# EAGLE design sensor_pcb (EAGLE 7.0.0)
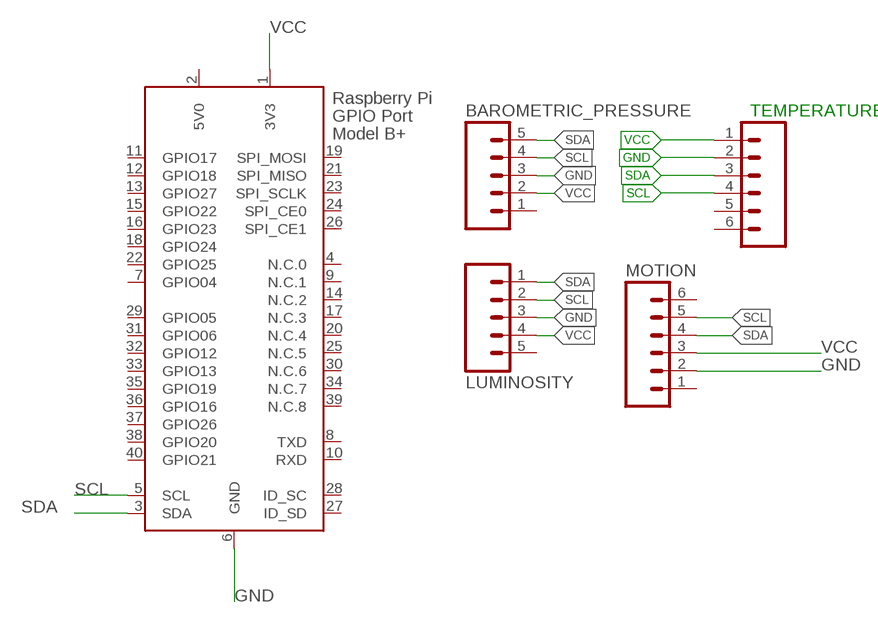
[diagram p0: schematic, sheet 1]

## Parts
BAROMETRIC_PRESSURE  M05_ROUNDONLY_NOSILK  [1X05_ROUNDONLY_NOSILK]
LUMINOSITY  M05_ROUNDONLY_NOSILK  [1X05_ROUNDONLY_NOSILK]
MOTION  M06SIP  [1X06]
TEMPERATURE  M06SIP  [1X06]
X1  RASPI_BOARD_B+_E0  [RASPI_BOARD_B+_EDGES_0DRILL]

## Nets
GND: BAROMETRIC_PRESSURE.3 LUMINOSITY.3 MOTION.2 TEMPERATURE.2 X1.6(GND)
SCL: BAROMETRIC_PRESSURE.4 LUMINOSITY.2 MOTION.5 TEMPERATURE.4 X1.5(SCL)
SDA: BAROMETRIC_PRESSURE.5 LUMINOSITY.1 MOTION.4 TEMPERATURE.3 X1.3(SDA)
VCC: BAROMETRIC_PRESSURE.2 LUMINOSITY.4 MOTION.3 TEMPERATURE.1 X1.1(3V3)
Unconnected: BAROMETRIC_PRESSURE.1 LUMINOSITY.5 MOTION.1 MOTION.6 TEMPERATURE.5 TEMPERATURE.6 X1.4(N.C.0) X1.7(GPIO04) X1.8(TXD) X1.9(N.C.1) X1.10(RXD) X1.11(GPIO17) X1.12(GPIO18) X1.13(GPIO27) X1.14(N.C.2) X1.15(GPIO22) X1.16(GPIO23) X1.17(N.C.3) X1.18(GPIO24) X1.19(SPI_MOSI) X1.20(N.C.4) X1.21(SPI_MISO) X1.22(GPIO25) X1.23(SPI_SCLK) X1.24(SPI_CE0) X1.25(N.C.5) X1.26(SPI_CE1) X1.27(ID_SD) X1.28(ID_SC) X1.29(GPIO05) X1.30(N.C.6) X1.31(GPIO06) X1.32(GPIO12) X1.33(GPIO13) X1.34(N.C.7) X1.35(GPIO19) X1.36(GPIO16) X1.37(GPIO26) X1.38(GPIO20) X1.39(N.C.8) X1.40(GPIO21)

## Power pins joined to a net without a drawn wire
5V0: X1.2(5V0)

## Library data of the parts
BAROMETRIC_PRESSURE LUMINOSITY = mike-temp:M05: Header 5 Standard 5-pin 0.1" header. Use with straight break away headers (SKU : PRT-00116), right angle break away headers (PRT-00553), swiss pins (PRT-00743), machine pins (PRT-00117), and female headers (PRT-00115). Molex polarized connector foot print use with SKU : PRT-08230 with associated crimp pins and housings.
MOTION = SparkFun-Connectors:M06: Header 6 Standard 6-pin 0.1" header. Use with straight break away headers (SKU : PRT-00116), right angle break away headers (PRT-00553), swiss pins (PRT-00743), machine pins (PRT-00117), and female headers (PRT-00115). Molex polarized connector foot print use with SKU : PRT-08094 with associated ...
TEMPERATURE = SparkFun:M06: Header 6 Standard 6-pin 0.1" header. Use with straight break away headers (SKU : PRT-00116), right angle break away headers (PRT-00553), swiss pins (PRT-00743), machine pins (PRT-00117), and female headers (PRT-00115). Molex polarized connector foot print use with SKU : PRT-08094 with associated ...
X1 = raspberrypi_bastelstube_v13:RASPI_BOARD_B+: Raspberry Pi GPIO connector with markings for the outer dimensions of the Raspberry Pi board model B+ with different sets of drill holes or mounting pads

## Board
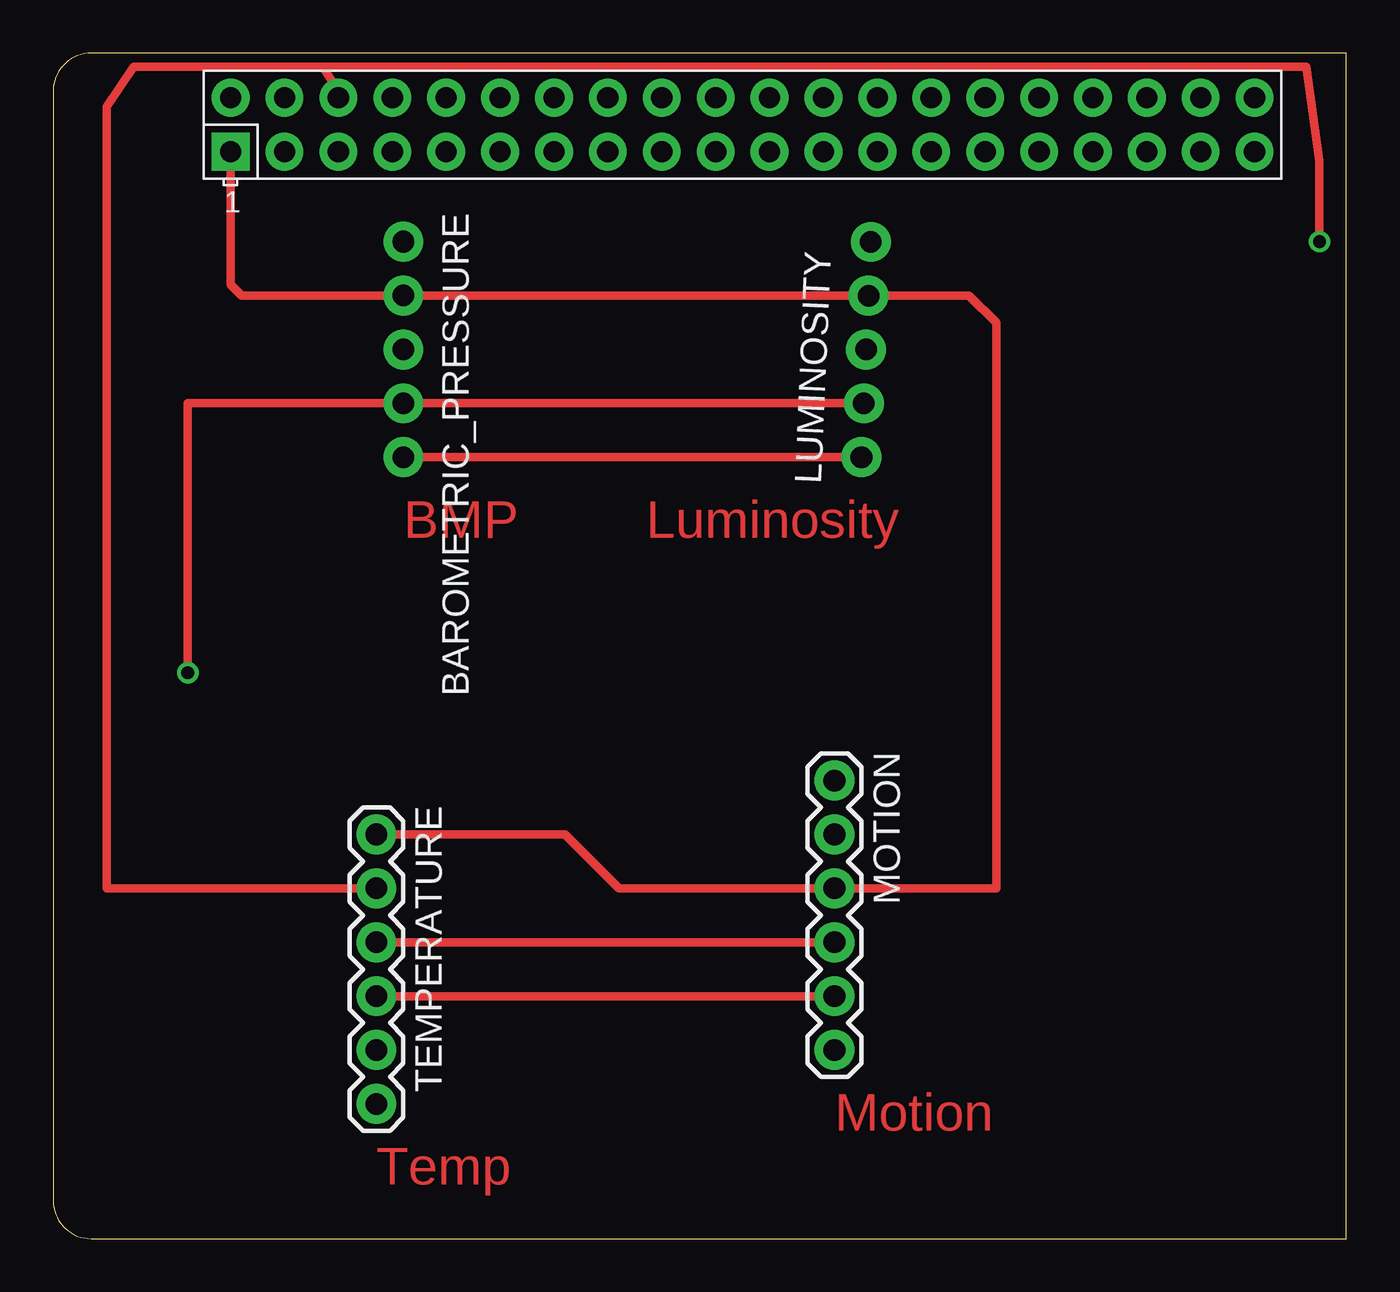
[diagram p1: board, top side]
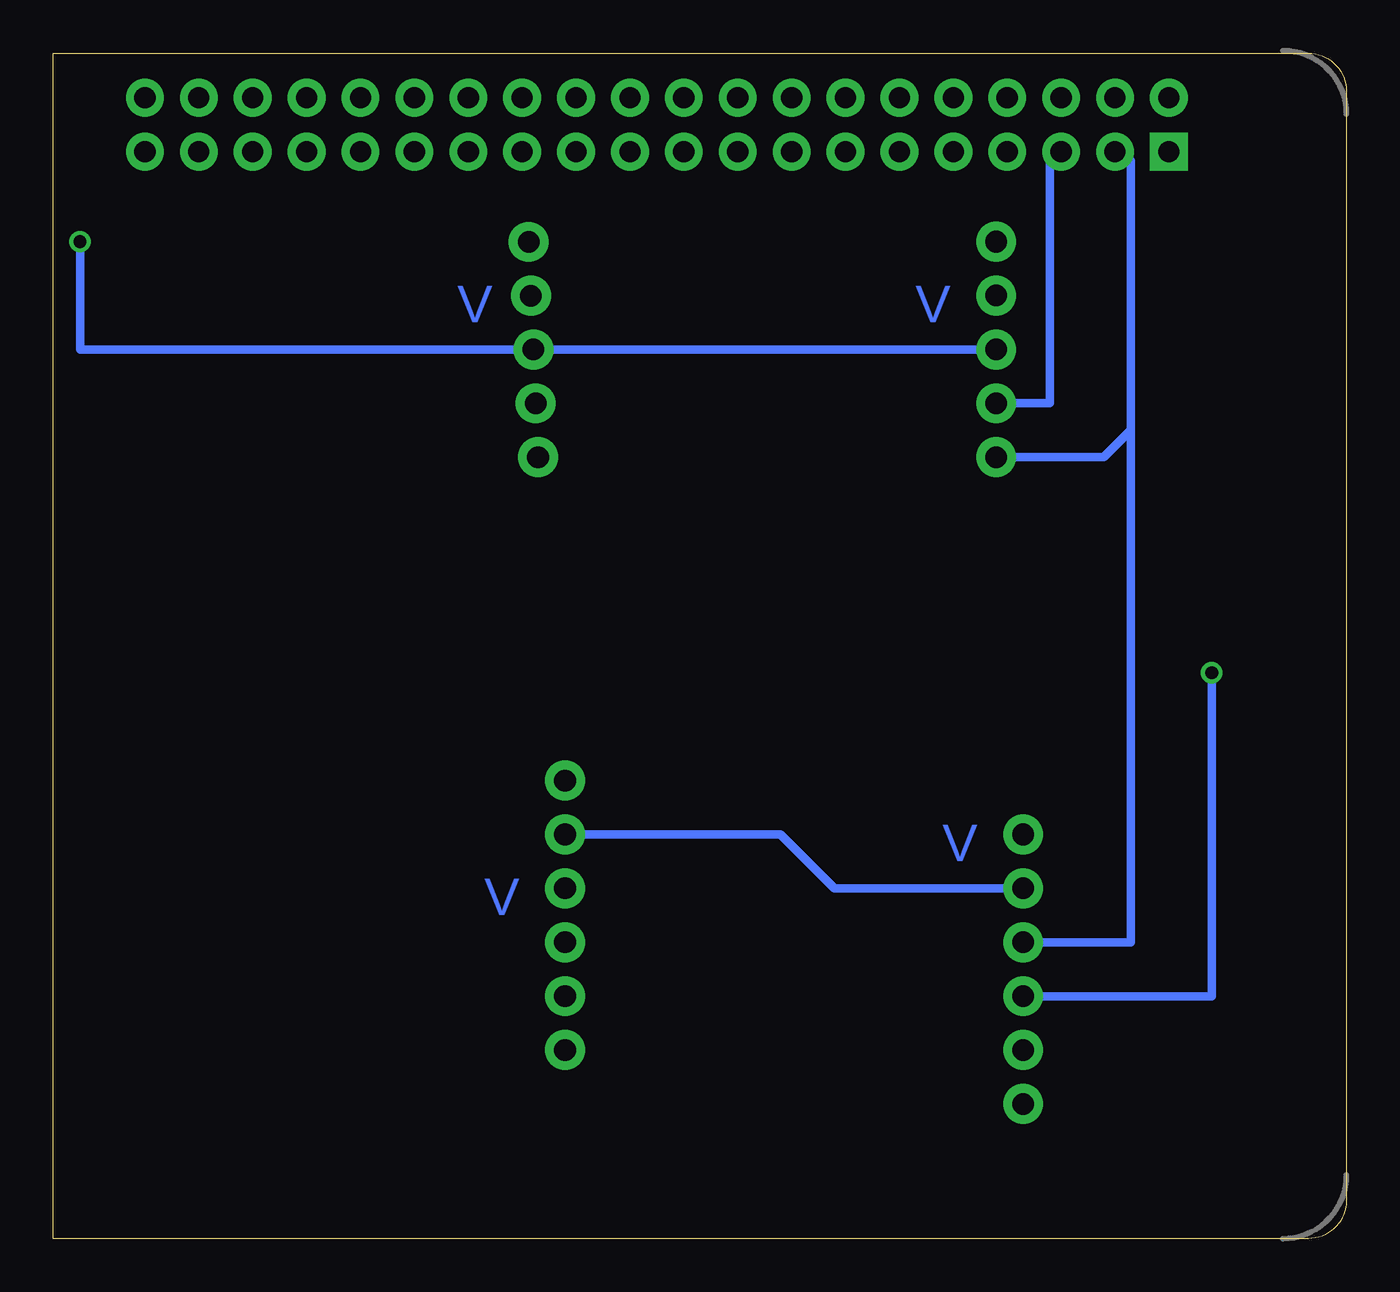
[diagram p2: board, bottom side, seen from below]

Size 60.96 x 55.88 mm. Coordinates in mm from the lower left corner, seen from the top.
Outline: 0,54.08 0,1.8 arc90 1.8,0 60.94,0 60.96,55.88 1.8,55.88 arc90 0,54.08
Copper layers (1*16): Top 0.035mm / dielectric 1.5mm / Bottom 0.035mm
Design rules "default": minimum track width 10mil, minimum drill 24mil, track to track 8mil, track to pad 8mil, pad to pad 8mil, via to via 8mil, smd to smd 8mil, copper to edge 40mil, drill to drill 8mil, minimum pad ring 10mil, minimum via ring 8mil, stop-mask expansion 4mil, vias tented up to drill 0mil, thermal gap 10mil

### Footprints (pad centres in the part's own frame; a part is rotated, then mirrored left to right if it is on the bottom)
1X05_ROUNDONLY_NOSILK = drill 1.016 pad 1.88: 1 0,0; 2 2.54,0; 3 5.08,0; 4 7.62,0; 5 10.16,0
1X06 = drill 1.016 pad 1.88: 1 0,0; 2 2.54,0; 3 5.08,0; 4 7.62,0; 5 10.16,0; 6 12.7,0
RASPI_BOARD_B+_EDGES_0DRILL = drill 1 pad 1.778 square: 1 8.37,51.23 | drill 1 pad 1.778: 2 8.37,53.77; 3 10.91,51.23; 4 10.91,53.77; 5 13.45,51.23; 6 13.45,53.77; 7 15.99,51.23; 8 15.99,53.77; 9 18.53,51.23; 10 18.53,53.77; 11 21.07,51.23; 12 21.07,53.77; 13 23.61,51.23; 14 23.61,53.77; 15 26.15,51.23; 16 26.15,53.77; 17 28.69,51.23; 18 28.69,53.77; 19 31.23,51.23; 20 31.23,53.77; 21 33.77,51.23; 22 33.77,53.77; 23 36.31,51.23; 24 36.31,53.77; 25 38.85,51.23; 26 38.85,53.77; 27 41.39,51.23; 28 41.39,53.77; 29 43.93,51.23; 30 43.93,53.77; 31 46.47,51.23; 32 46.47,53.77; 33 49.01,51.23; 34 49.01,53.77; 35 51.55,51.23; 36 51.55,53.77; 37 54.09,51.23; 38 54.09,53.77; 39 56.63,51.23; 40 56.63,53.77

### Placement (x,y rotation side)
BAROMETRIC_PRESSURE  16.51,46.99 270 top
LUMINOSITY  38.1,36.83 87.5 top
MOTION  36.83,21.59 270 top
TEMPERATURE  15.24,19.05 270 top
X1  0,0 0 top

### Tracks (layer width: path | path; a pad name or v marks a point on that pad's centre or on a via)
GND  (via drill 0.6)
  Top 0.406: X1.6 13.45,54.09 12.7,55.24 | 12.7,55.24 59.05,55.24 59.69,50.8 v59.69,46.99 | TEMPERATURE.2 2.54,16.51 2.54,53.34 3.81,55.24 12.7,55.24
  Bottom 0.406: BAROMETRIC_PRESSURE.3 LUMINOSITY.3 59.69,41.91 59.69,43.18 v59.69,46.99 | MOTION.2 26.67,19.05 24.13,16.51 TEMPERATURE.2
SCL  (via drill 0.6)
  Top 0.406: LUMINOSITY.2 BAROMETRIC_PRESSURE.4 6.35,39.37 v6.35,26.67 | TEMPERATURE.4 MOTION.5
  Bottom 0.406: X1.5 13.54,51.23 13.97,50.8 13.97,39.37 BAROMETRIC_PRESSURE.4 | TEMPERATURE.4 6.35,11.43 v6.35,26.67
SDA
  Top 0.406: BAROMETRIC_PRESSURE.5 LUMINOSITY.1 | TEMPERATURE.3 MOTION.4
  Bottom 0.406: X1.3 10.59,51.23 10.16,50.8 10.16,38.1 | 10.16,38.1 11.43,36.83 BAROMETRIC_PRESSURE.5 | TEMPERATURE.3 10.16,13.97 10.16,38.1
VCC
  Top 0.406: X1.1 8.37,44.97 8.89,44.45 BAROMETRIC_PRESSURE.2 LUMINOSITY.4 43.17,44.44 44.45,43.18 44.45,16.51 MOTION.3 26.67,16.51 24.13,19.05 TEMPERATURE.1

### Text on the board
Top: BMP | Luminosity | Motion | Temp
Bottom: V | V | V | V